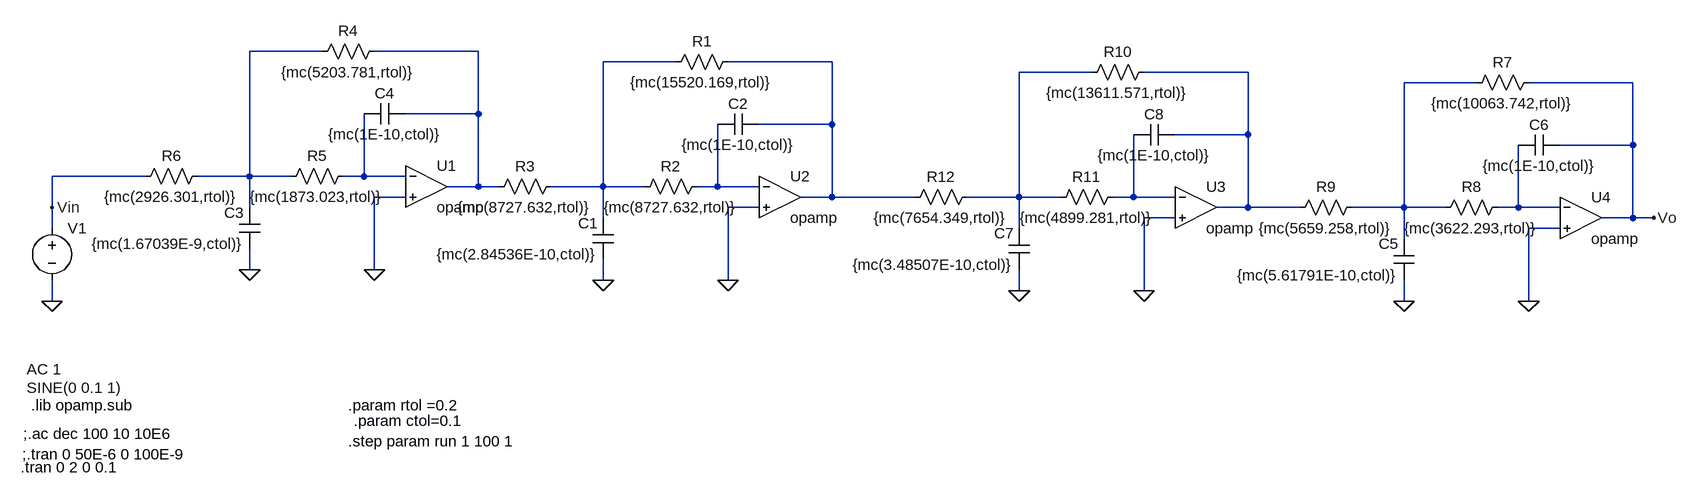
[diagram p0: schematic Draft1.asc]
Draft1.asc, the LTspice schematic file:
Version 4
SHEET 1 1648 680
WIRE -448 -112 -560 -112
WIRE -208 -112 -368 -112
WIRE 96 -96 -16 -96
WIRE 336 -96 176 -96
WIRE 736 -80 624 -80
WIRE 976 -80 816 -80
WIRE 1328 -64 1216 -64
WIRE 1568 -64 1408 -64
WIRE -208 -16 -208 -112
WIRE -208 -16 -320 -16
WIRE 336 0 336 -96
WIRE 336 0 224 0
WIRE 976 16 976 -80
WIRE 976 16 864 16
WIRE 1568 32 1568 -64
WIRE 1568 32 1456 32
WIRE -720 80 -864 80
WIRE -560 80 -560 -112
WIRE -560 80 -640 80
WIRE -496 80 -560 80
WIRE -384 80 -384 -16
WIRE -384 80 -416 80
WIRE -320 80 -384 80
WIRE -208 96 -208 -16
WIRE -208 96 -256 96
WIRE -176 96 -208 96
WIRE -16 96 -16 -96
WIRE -16 96 -96 96
WIRE 48 96 -16 96
WIRE 160 96 160 0
WIRE 160 96 128 96
WIRE 224 96 160 96
WIRE -320 112 -368 112
WIRE 336 112 336 0
WIRE 336 112 288 112
WIRE 464 112 336 112
WIRE 624 112 624 -80
WIRE 624 112 544 112
WIRE 688 112 624 112
WIRE 800 112 800 16
WIRE 800 112 768 112
WIRE 864 112 800 112
WIRE -864 128 -864 80
WIRE -560 128 -560 80
WIRE 224 128 176 128
WIRE 976 128 976 16
WIRE 976 128 928 128
WIRE 1056 128 976 128
WIRE 1216 128 1216 -64
WIRE 1216 128 1136 128
WIRE 1280 128 1216 128
WIRE 1392 128 1392 32
WIRE 1392 128 1360 128
WIRE 1456 128 1392 128
WIRE -16 144 -16 96
WIRE 864 144 816 144
WIRE 1568 144 1568 32
WIRE 1568 144 1520 144
WIRE 1600 144 1568 144
WIRE -864 160 -864 128
WIRE 624 160 624 112
WIRE 1456 160 1408 160
WIRE 1216 176 1216 128
WIRE -560 224 -560 192
WIRE -368 224 -368 112
WIRE -16 240 -16 208
WIRE 176 240 176 128
WIRE 624 256 624 224
WIRE 816 256 816 144
WIRE -864 272 -864 240
WIRE 1216 272 1216 240
WIRE 1408 272 1408 160
FLAG 176 240 0
FLAG -16 240 0
FLAG -864 272 0
FLAG 1600 144 Vo
FLAG -864 128 Vin
FLAG -368 224 0
FLAG -560 224 0
FLAG 1408 272 0
FLAG 1216 272 0
FLAG 816 256 0
FLAG 624 256 0
SYMBOL res 192 -112 R90
WINDOW 0 0 56 VBottom 2
WINDOW 3 32 56 VTop 2
SYMATTR InstName R1
SYMATTR Value {mc(15520.169,rtol)}
SYMBOL res 144 80 R90
WINDOW 0 0 56 VBottom 2
WINDOW 3 32 56 VTop 2
SYMATTR InstName R2
SYMATTR Value {mc(8727.632,rtol)}
SYMBOL res -80 80 R90
WINDOW 0 0 56 VBottom 2
WINDOW 3 32 56 VTop 2
SYMATTR InstName R3
SYMATTR Value {mc(8727.632,rtol)}
SYMBOL cap 0 208 R180
WINDOW 0 24 56 Left 2
WINDOW 3 24 8 Left 2
SYMATTR InstName C1
SYMATTR Value {mc(2.84536E-10,ctol)}
SYMBOL cap 160 16 R270
WINDOW 0 32 32 VTop 2
WINDOW 3 0 32 VBottom 2
SYMATTR InstName C2
SYMATTR Value {mc(1E-10,ctol)}
SYMBOL voltage -864 144 R0
WINDOW 123 -39 233 Left 2
WINDOW 39 0 0 Left 0
WINDOW 3 -39 261 Left 2
SYMATTR Value2 AC 1
SYMATTR Value SINE(0 0.1 1)
SYMATTR InstName V1
SYMBOL res -352 -128 R90
WINDOW 0 0 56 VBottom 2
WINDOW 3 32 56 VTop 2
SYMATTR InstName R4
SYMATTR Value {mc(5203.781,rtol)}
SYMBOL res -400 64 R90
WINDOW 0 0 56 VBottom 2
WINDOW 3 32 56 VTop 2
SYMATTR InstName R5
SYMATTR Value {mc(1873.023,rtol)}
SYMBOL res -624 64 R90
WINDOW 0 0 56 VBottom 2
WINDOW 3 32 56 VTop 2
SYMATTR InstName R6
SYMATTR Value {mc(2926.301,rtol)}
SYMBOL cap -544 192 R180
WINDOW 0 24 56 Left 2
WINDOW 3 24 8 Left 2
SYMATTR InstName C3
SYMATTR Value {mc(1.67039E-9,ctol)}
SYMBOL cap -384 0 R270
WINDOW 0 32 32 VTop 2
WINDOW 3 0 32 VBottom 2
SYMATTR InstName C4
SYMATTR Value {mc(1E-10,ctol)}
SYMBOL res 1424 -80 R90
WINDOW 0 0 56 VBottom 2
WINDOW 3 32 56 VTop 2
SYMATTR InstName R7
SYMATTR Value {mc(10063.742,rtol)}
SYMBOL res 1376 112 R90
WINDOW 0 0 56 VBottom 2
WINDOW 3 32 56 VTop 2
SYMATTR InstName R8
SYMATTR Value {mc(3622.293,rtol)}
SYMBOL res 1152 112 R90
WINDOW 0 0 56 VBottom 2
WINDOW 3 32 56 VTop 2
SYMATTR InstName R9
SYMATTR Value {mc(5659.258,rtol)}
SYMBOL cap 1232 240 R180
WINDOW 0 24 56 Left 2
WINDOW 3 24 8 Left 2
SYMATTR InstName C5
SYMATTR Value {mc(5.61791E-10,ctol)}
SYMBOL cap 1392 48 R270
WINDOW 0 32 32 VTop 2
WINDOW 3 0 32 VBottom 2
SYMATTR InstName C6
SYMATTR Value {mc(1E-10,ctol)}
SYMBOL res 832 -96 R90
WINDOW 0 0 56 VBottom 2
WINDOW 3 32 56 VTop 2
SYMATTR InstName R10
SYMATTR Value {mc(13611.571,rtol)}
SYMBOL res 784 96 R90
WINDOW 0 0 56 VBottom 2
WINDOW 3 32 56 VTop 2
SYMATTR InstName R11
SYMATTR Value {mc(4899.281,rtol)}
SYMBOL res 560 96 R90
WINDOW 0 0 56 VBottom 2
WINDOW 3 32 56 VTop 2
SYMATTR InstName R12
SYMATTR Value {mc(7654.349,rtol)}
SYMBOL cap 640 224 R180
WINDOW 0 24 56 Left 2
WINDOW 3 24 8 Left 2
SYMATTR InstName C7
SYMATTR Value {mc(3.48507E-10,ctol)}
SYMBOL cap 800 32 R270
WINDOW 0 32 32 VTop 2
WINDOW 3 0 32 VBottom 2
SYMATTR InstName C8
SYMATTR Value {mc(1E-10,ctol)}
SYMBOL Opamps\\opamp -288 32 R0
SYMATTR InstName U1
SYMBOL Opamps\\opamp 256 48 R0
SYMATTR InstName U2
SYMBOL Opamps\\opamp 896 64 R0
SYMATTR InstName U3
SYMBOL Opamps\\opamp 1488 80 R0
SYMATTR InstName U4
TEXT -408 432 Left 2 !.param rtol =0.2
TEXT -400 456 Left 2 !.param ctol=0.1
TEXT -908 476 Left 2 !;.ac dec 100 10 10E6
TEXT -408 488 Left 2 !.step param run 1 100 1
TEXT -896 432 Left 2 !.lib opamp.sub
TEXT -910 508 Left 2 !;.tran 0 50E-6 0 100E-9
TEXT -912 528 Left 2 !.tran 0 2 0 0.1

The netlist it stands for:
* Draft1.asc
R1 N004 N003 {mc(15520.169,rtol)}
R2 N009 N003 {mc(8727.632,rtol)}
R3 N003 N002 {mc(8727.632,rtol)}
C1 0 N003 {mc(2.84536E-10,ctol)}
C2 N009 N004 {mc(1E-10,ctol)}
V1 Vin 0 SINE(0 0.1 1) AC 1
R4 N002 N001 {mc(5203.781,rtol)}
R5 N008 N001 {mc(1873.023,rtol)}
R6 N001 Vin {mc(2926.301,rtol)}
C3 0 N001 {mc(1.67039E-9,ctol)}
C4 N008 N002 {mc(1E-10,ctol)}
R7 Vo N007 {mc(10063.742,rtol)}
R8 N011 N007 {mc(3622.293,rtol)}
R9 N007 N006 {mc(5659.258,rtol)}
C5 0 N007 {mc(5.61791E-10,ctol)}
C6 N011 Vo {mc(1E-10,ctol)}
R10 N006 N005 {mc(13611.571,rtol)}
R11 N010 N005 {mc(4899.281,rtol)}
R12 N005 N004 {mc(7654.349,rtol)}
C7 0 N005 {mc(3.48507E-10,ctol)}
C8 N010 N006 {mc(1E-10,ctol)}
XU1 N008 0 N002 opamp Aol=100K GBW=10Meg  ; pins invin noninvin out
XU2 N009 0 N004 opamp Aol=100K GBW=10Meg  ; pins invin noninvin out
XU3 N010 0 N006 opamp Aol=100K GBW=10Meg  ; pins invin noninvin out
XU4 N011 0 Vo opamp Aol=100K GBW=10Meg  ; pins invin noninvin out
.param rtol =0.2
.param ctol=0.1
;.ac dec 100 10 10E6
.step param run 1 100 1
.lib opamp.sub
;.tran 0 50E-6 0 100E-9
.tran 0 2 0 0.1
.backanno
.end